# EAGLE schematic 307 (EAGLE 9.6.2)
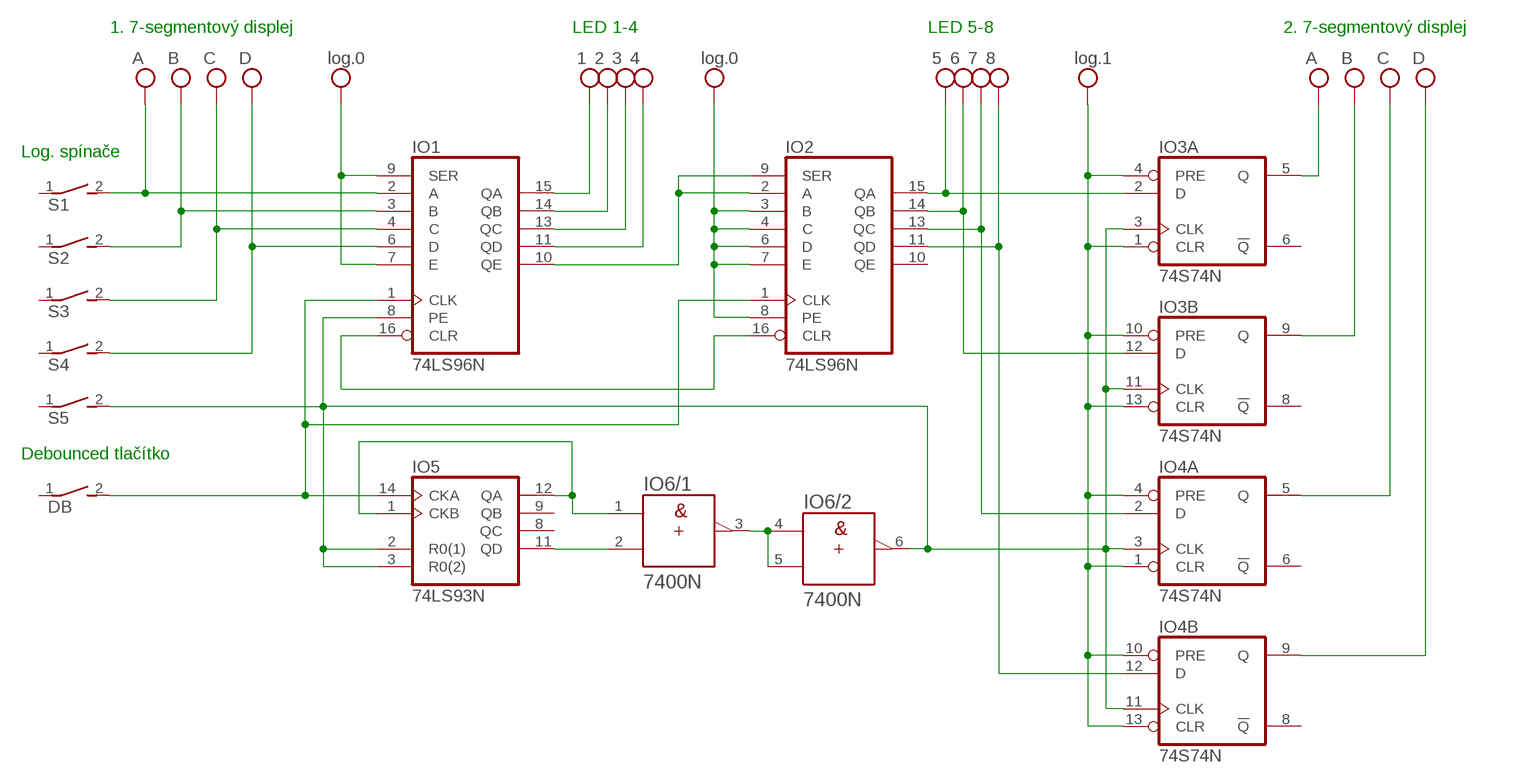
[diagram p0: schematic, sheet 1]

## Parts
DB  DS01E  [DS-01]
IO1  74LS96N  [DIL16]
IO2  74LS96N  [DIL16]
IO3  74S74N  [DIL14]
IO4  74S74N  [DIL14]
IO5  74LS93N  [DIL14]
IO6  7400N  [DIL14]
S1  DS01E  [DS-01]
S2  DS01E  [DS-01]
S3  DS01E  [DS-01]
S4  DS01E  [DS-01]
S5  DS01E  [DS-01]

## Nets
N$1: IO6.3(/1:Y) IO6.4(/2:A) IO6.5(/2:B)
N$2: IO5.11(QD) IO6.2(/1:B)
N$9: IO1.10(QE) IO2.2(A) IO2.9(SER)
N$10: IO1.16(CLR) IO2.16(CLR)
N$11: DB.2 IO1.1(CLK) IO2.1(CLK) IO5.14(CKA)
N$12: IO5.1(CKB) IO5.12(QA) IO6.1(/1:A)
N$18: IO1.8(PE) IO3.3(A:CLK) IO3.11(B:CLK) IO4.3(A:CLK) IO4.11(B:CLK) IO5.2(R0(1)) IO5.3(R0(2)) IO6.6(/2:Y) S5.2
VCC: IO1.2(A) IO1.3(B) IO1.4(C) IO1.6(D) IO1.7(E) IO1.9(SER) IO1.11(QD) IO1.13(QC) IO1.14(QB) IO1.15(QA) IO2.3(B) IO2.4(C) IO2.6(D) IO2.7(E) IO2.8(PE) IO2.11(QD) IO2.13(QC) IO2.14(QB) IO2.15(QA) IO3.1(A:CLR) IO3.2(A:D) IO3.4(A:PRE) IO3.5(A:Q) IO3.9(B:Q) IO3.10(B:PRE) IO3.12(B:D) IO3.13(B:CLR) IO4.1(A:CLR) IO4.2(A:D) IO4.4(A:PRE) IO4.5(A:Q) IO4.9(B:Q) IO4.10(B:PRE) IO4.12(B:D) IO4.13(B:CLR) S1.2 S2.2 S3.2 S4.2 ; supply symbol labelled log.0, 1, 2, 3, 4, 5, 6, 7, 8, A, B, C, D, log.1
Unconnected: DB.1 IO2.10(QE) IO3.6(A:!Q) IO3.8(B:!Q) IO4.6(A:!Q) IO4.8(B:!Q) IO5.8(QC) IO5.9(QB) IO6.8(/3:Y) IO6.9(/3:A) IO6.10(/3:B) IO6.11(/4:Y) IO6.12(/4:A) IO6.13(/4:B) S1.1 S2.1 S3.1 S4.1 S5.1

## Notes on the sheet
- 1. 7-segmentový displej | LED 1-4 | LED 5-8 | 2. 7-segmentový displej
- Log. spínače
- Debounced tlačítko

## Power pins joined to a net without a drawn wire
+UB: IO6.14(/+UB:+UB)
-UB: IO6.7(/-UB:-UB)
GND: IO1.12(GND) IO2.12(GND) IO3.7(P:GND) IO4.7(P:GND) IO5.10(GND)
VCC: IO1.5(VCC) IO2.5(VCC) IO3.14(P:VCC) IO4.14(P:VCC) IO5.5(VCC)

## Library data of the parts
DB S1-S5 = switch-dil:DS01E: DIL/CODE SWITCH; OC_FARNELL: unknown; OC_NEWARK: unknown
IO1 IO2 = 74xx-eu:74*96: 5-bit SHIFT REGISTER
IO3 IO4 = 74xx-eu:74*74: Dual D type positive edge triggered FLIP FLOP, preset and clear
IO5 = 74xx-eu:74*93: Decade, divide by twelve and binary COUNTER
IO6 = 74ttl-din:74*00: Quad 2-input NAND gate